# Altium schematic sheet [5] ButtonsAndLeds.SchDoc
size A3; DocumentNumber: 5; SheetNumber: 5; SheetTotal: 9
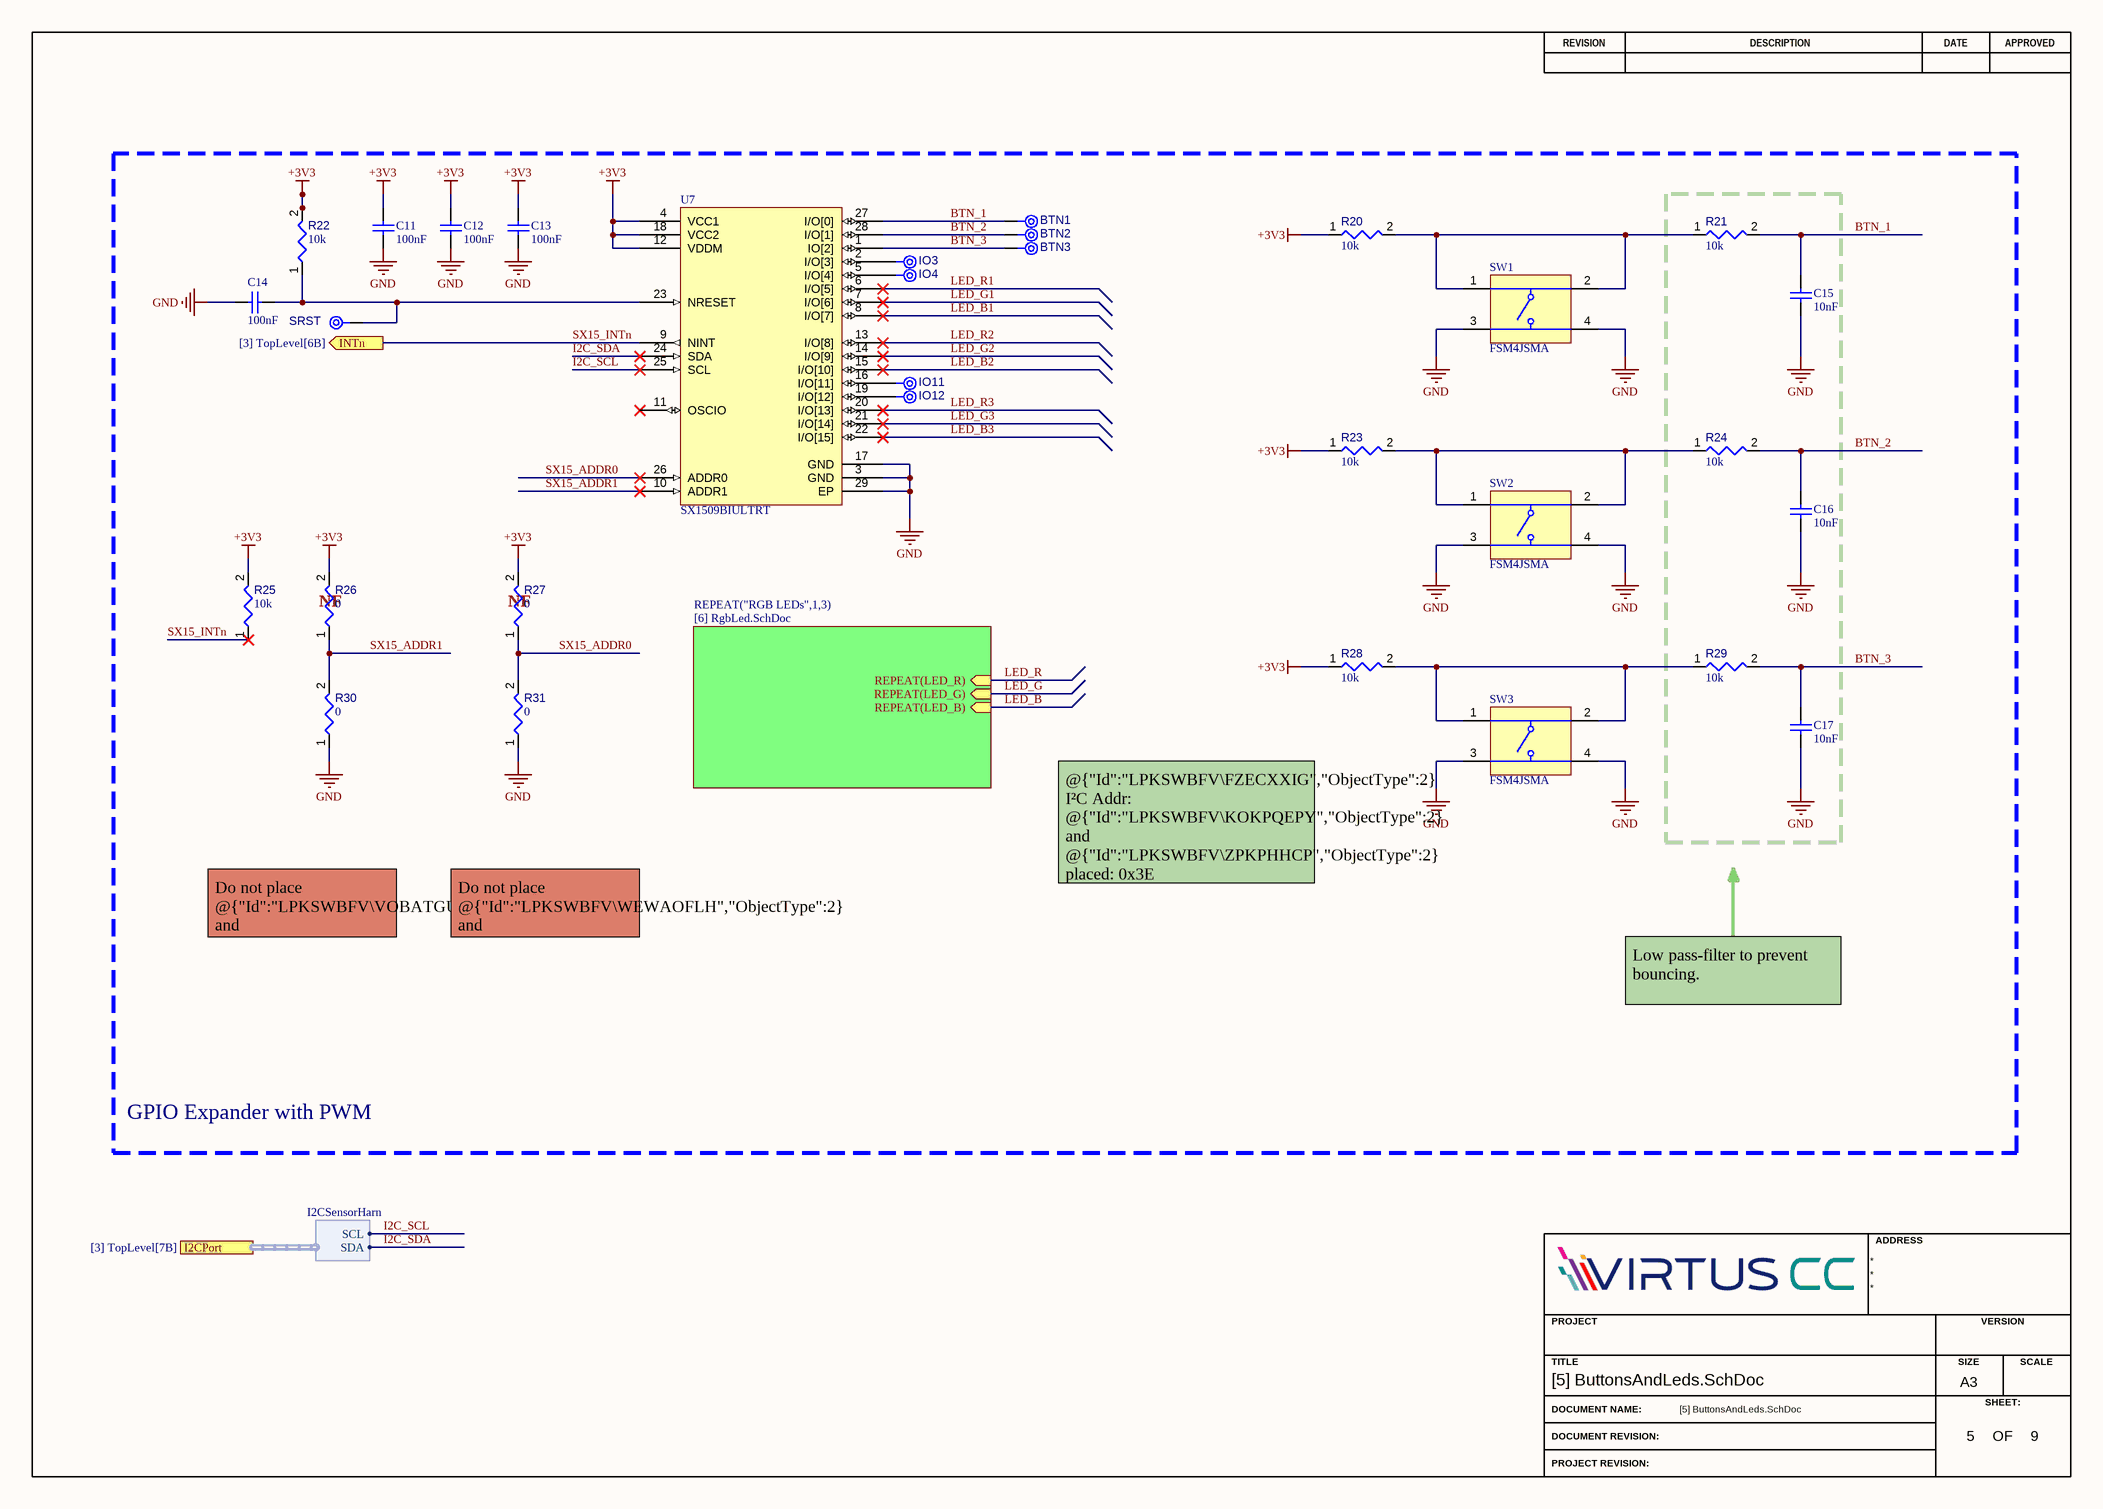
[diagram p0: [5] ButtonsAndLeds.SchDoc]

## Parts
BTN1  TPAD6R  [TP06R]  (value not drawn)  (no BOM)
BTN2  TPAD6R  [TP06R]  (value not drawn)  (no BOM)
BTN3  TPAD6R  [TP06R]  (value not drawn)  (no BOM)
C11  value 100nF  [CAPC0603(1608)100_L]  (hidden comment: VJ0603Y104MXJCW1BC)
C12  value 100nF  [CAPC0603(1608)100_L]  (hidden comment: VJ0603Y104MXJCW1BC)
C13  value 100nF  [CAPC0603(1608)100_L]  (hidden comment: VJ0603Y104MXJCW1BC)
C14  value 100nF  [CAPC0603(1608)100_L]  (hidden comment: VJ0603Y104MXJCW1BC)
C15  value 10nF  [CAPC0603(1608)100_L]  (hidden comment: VJ0603Y103KXAAC)
C16  value 10nF  [CAPC0603(1608)100_L]  (hidden comment: VJ0603Y103KXAAC)
C17  value 10nF  [CAPC0603(1608)100_L]  (hidden comment: VJ0603Y103KXAAC)
IO3  TPAD6R  [TP06R]  (value not drawn)  (no BOM)
IO4  TPAD6R  [TP06R]  (value not drawn)  (no BOM)
IO11  TPAD6R  [TP06R]  (value not drawn)  (no BOM)
IO12  TPAD6R  [TP06R]  (value not drawn)  (no BOM)
R20  value 10k  [RESC0603(1608)_L]  (hidden comment: Resistor 10k +/-1% 0603 100 mW)
R21  value 10k  [RESC0603(1608)_L]  (hidden comment: Resistor 10k +/-1% 0603 100 mW)
R22  value 10k  [RESC0603(1608)_L]  (hidden comment: Resistor 10k +/-1% 0603 100 mW)
R23  value 10k  [RESC0603(1608)_L]  (hidden comment: Resistor 10k +/-1% 0603 100 mW)
R24  value 10k  [RESC0603(1608)_L]  (hidden comment: Resistor 10k +/-1% 0603 100 mW)
R25  value 10k  [RESC0603(1608)_L]  (hidden comment: Resistor 10k +/-1% 0603 100 mW)
R26  value 0  [RESC0603(1608)_L]  (hidden comment: Resistor 0R +/- 5% 0603 100 mW)
R27  value 0  [RESC0603(1608)_L]  (hidden comment: Resistor 0R +/- 5% 0603 100 mW)
R28  value 10k  [RESC0603(1608)_L]  (hidden comment: Resistor 10k +/-1% 0603 100 mW)
R29  value 10k  [RESC0603(1608)_L]  (hidden comment: Resistor 10k +/-1% 0603 100 mW)
R30  value 0  [RESC0603(1608)_L]  (hidden comment: Resistor 0R +/- 5% 0603 100 mW)
R31  value 0  [RESC0603(1608)_L]  (hidden comment: Resistor 0R +/- 5% 0603 100 mW)
SRST  TPAD6R  [TP06R]  (value not drawn)  (no BOM)
SW1  FSM4JSMA  [TECO-FSM4JSMA_V]
SW2  FSM4JSMA  [TECO-FSM4JSMA_V]
SW3  FSM4JSMA  [TECO-FSM4JSMA_V]
U7  SX1509BIULTRT  [QFN40P410X410X60_HS-29N]

## Sub-sheets
REPEAT("RGB LEDs",1,3) = [6] RgbLed.SchDoc: REPEAT(LED_B) (in), REPEAT(LED_G) (in), REPEAT(LED_R) (in)

## Ports
I2CPort (harness I2CSensorHarn, see [3] TopLevel[7B]), INTn (out, see [3] TopLevel[6B])

## Harnesses
I2CSensorHarn: SCL, SDA

## Nets
+3V3: C11.2 C12.2 C13.2 R20.1 R22.2 R23.1 R25.2 R26.2 R27.2 R28.1 U7.4(VCC1) U7.12(VDDM) U7.18(VCC2)
GND: C11.1 C12.1 C13.1 C14.1 C15.1 C16.1 C17.1 R30.1 R31.1 SW1.3 SW1.4 SW2.3 SW2.4 SW3.3 SW3.4 U7.3(GND) U7.17(GND) U7.29(EP)
BTN_1: BTN1.1(TP) C15.2 R21.2 U7.27(I/O[0])
BTN_2: BTN2.1(TP) C16.2 R24.2 U7.28(I/O[1])
BTN_3: BTN3.1(TP) C17.2 R29.2 U7.1(IO[2])
I2C_SCL: U7.25(SCL) ; port I2CPort.SCL
I2C_SDA: U7.24(SDA) ; port I2CPort.SDA
LED_B: sheet REPEAT("RGB LEDs",1,3)/REPEAT(LED_B)
LED_B1: U7.8(I/O[7])
LED_B2: U7.15(I/O[10])
LED_B3: U7.22(I/O[15])
LED_G: sheet REPEAT("RGB LEDs",1,3)/REPEAT(LED_G)
LED_G1: U7.7(I/O[6])
LED_G2: U7.14(I/O[9])
LED_G3: U7.21(I/O[14])
LED_R: sheet REPEAT("RGB LEDs",1,3)/REPEAT(LED_R)
LED_R1: U7.6(I/O[5])
LED_R2: U7.13(I/O[8])
LED_R3: U7.20(I/O[13])
SX15_ADDR0: R27.1 R31.2 U7.26(ADDR0)
SX15_ADDR1: R26.1 R30.2 U7.10(ADDR1)
SX15_INTn: R25.1 U7.9(NINT) ; port INTn
NetC14_2: C14.2 R22.1 SRST.1(TP) U7.23(NRESET)
NetIO3_1: IO3.1(TP) U7.2(I/O[3])
NetIO4_1: IO4.1(TP) U7.5(I/O[4])
NetIO11_1: IO11.1(TP) U7.16(I/O[11])
NetIO12_1: IO12.1(TP) U7.19(I/O[12])
NetR20_2: R20.2 R21.1 SW1.1 SW1.2
NetR23_2: R23.2 R24.1 SW2.1 SW2.2
NetR28_2: R28.2 R29.1 SW3.1 SW3.2

Not connected (* = marked no-connect by the designer): U7 11(OSCIO)*

## Notes on the sheet
- (near R26) NF
- (near R27) NF
- @{"Id":"LPKSWBFV\FZECXXIG","ObjectType":2} I²C Addr:
  @{"Id":"LPKSWBFV\KOKPQEPY","ObjectType":2} and @{"Id":"LPKSWBFV\ZPKPHHCP","ObjectType":2} placed: 0x3E
  @{"Id":"LPKSWBFV\KOKPQEPY","ObjectType":2} and @{"Id":"LPKSWBFV\WEWAOFLH","ObjectType":2} placed: 0x3F
  @{"Id":"LPKSWBFV\VOBATGUE","ObjectType":2}  and @{"Id":"LPKSWBFV\ZPKPHHCP","ObjectType":2} placed: 0x70
  @{"Id":"LPKSWBFV\VOBATGUE","ObjectType":2} and @{"Id":"LPKSWBFV\WEWAOFLH","ObjectType":2} placed: 0x71
- Do not place @{"Id":"LPKSWBFV\VOBATGUE","ObjectType":2} and @{"Id":"LPKSWBFV\KOKPQEPY","ObjectType":2} simultaneously
- Do not place @{"Id":"LPKSWBFV\WEWAOFLH","ObjectType":2} and @{"Id":"LPKSWBFV\ZPKPHHCP","ObjectType":2} simultaneously
- Low pass-filter to prevent bouncing.
- GPIO Expander with PWM
- REVISION
- DESCRIPTION
- DATE
- APPROVED
- ADDRESS
- PROJECT
- VERSION
- TITLE
- A3
- SIZE
- SCALE
- DOCUMENT NAME:
- DOCUMENT REVISION:
- OF
- SHEET:
- PROJECT REVISION:

## Library data of the parts
BTN1-BTN3 IO3 IO4 IO11 IO12 SRST = CMP-00028-00002-2: 0.6mm round; Pins: 1; Component Type: Mechanical
C11-C14 = CMP-001-00085-1: Multilayer Ceramic Capacitor, 0.1 uF, 16 V, ± 20%, X7R, 0603 [1608 Metric]; Dielectric Material: Tantalum; Voltage Rating: 16V; Packaging: Tape and Reel; Min Operating Temperature: -55°C; Case/Package: 0603; Length: 1.6mm; Termination: SMD/SMT; Height: 0.95mm; Mounting Technology: Surface Mount; Width: 0.8mm; Case Code (Imperial): 0603; Construction: Flat; Lead Free: Lead Free; Package Quantity: 4000; Max Operating Temperature: 125°C; Dielectric: X7R; RoHS Compliant: Yes; Depth: 0.8mm; Tolerance: 20%; Series: VJ; Case Code (Metric): 1608; Voltage Rating (DC): 16V
C15-C17 = CMP-001-00084-1: Multilayer Ceramic Capacitor, 0.01 uF, 50 V, ± 10%, X7R, 0603 [1608 Metric]; Voltage Rating: 50V; Height: 0.92mm; Voltage Rating (DC): 50V; Depth: 0.8mm; Case Code (Imperial): 0603; Packaging: Tape and Reel; Length: 1.6mm; Max Operating Temperature: 125°C; Min Operating Temperature: -55°C; Case/Package: 0603; Pins: 2; Series: VJ; Thickness: 0.036inch; Weight: 7.1E-05oz; Reach SVHC Compliant: Unknown; Termination: SMD/SMT; Package Quantity: 1; RoHS Compliant: Yes; Mounting Technology: Surface Mount; Construction: Flat; Voltage: 50V; Lead Free: Lead Free; Width: 0.031inch; Case Code (Metric): 1608; Tolerance: 10%; Dielectric: X7R
R20-R25 R28 R29 = CMP-009-00017-7: Chip Resistor, 10 KOhm, +/- 1%, 01 W, -55 to 155 degC, 0603 (1608 Metric); Power: 100mW; Voltage Rating: 50V; Mounting Technology: SM; Max Operating Temperature: 155°C; Case/Package: 0603; Tolerance: 1%; RoHS Compliant: True; Pins: 2; Min Operating Temperature: -55°C
R26 R27 R30 R31 = CMP-009-00006-6: Chip Resistor, 0 Ohm, 0.1 W, -55 to 155 degC, 0603 (1608 Metric); Power: 100mW; Voltage Rating: 50V; Tolerance: 5%; Mounting Technology: SM; RoHS Compliant: True; Max Operating Temperature: 155°C; Min Operating Temperature: -55°C; Case/Package: 0603; Pins: 2
SW1-SW3 = CMP-011-00013-1: Switch Tactile OFF (ON) SPST Round Button Gull Wing 0.05A 12VDC 1.57N SMD Loose Piece; Max Current Rating: 50mA; Actuator Type: Standard; Switch Function: Off-Mom; Switch Travel: 0.25mm; Mechanical Life: 100000Cycles; Insulation Resistance: 100MR; Actuator Length: 1.4mm; Voltage Rating: 24V; Actuator Material: Polyphenylene; Illumination Type: Non-Illuminated,Illuminated; Contact Material: Copper Alloy,Silver; Throw Configuration: SPST; Termination: Gull Wing; Depth: 10mm; Series: FSMJSMA; Contact Current Rating: 50mA; ELV: Compliant; Min Operating Temperature: -35°C; Case/Package: SMD/SMT; Length: 6mm; Width: 6mm; Package Quantity: 750; Color: Black; Reach SVHC Compliant: Unknown; Contact Plating: Silver; Operating Force: 1.57N; Current Rating: 50mA; RoHS Compliant: Yes; Max Operating Temperature: 85°C; Lead Free: Lead Free; Voltage Rating (DC): 24V; Packaging: Bulk; Orientation: Straight; Mounting Technology: Surface Mount
U7 = CMP-016-00011-5: IC Gpio Expander I2C 16CH 28QFN / I2C Interface 5.5V 28-PIN Qfn-ut Ep T/r; Number of I/Os: 16; Frequency: 400kHz; Interface: I2C; Series: -; Min Operating Temperature: -40°C; RoHS Compliant: Yes; Pins: 28; Packaging: Cut Tape; Max Operating Temperature: 85°C; Mounting Technology: Surface Mount; Case/Package: QFN; Lead Free: Lead Free